# Altium project MiniChessBoard.PrjPcb
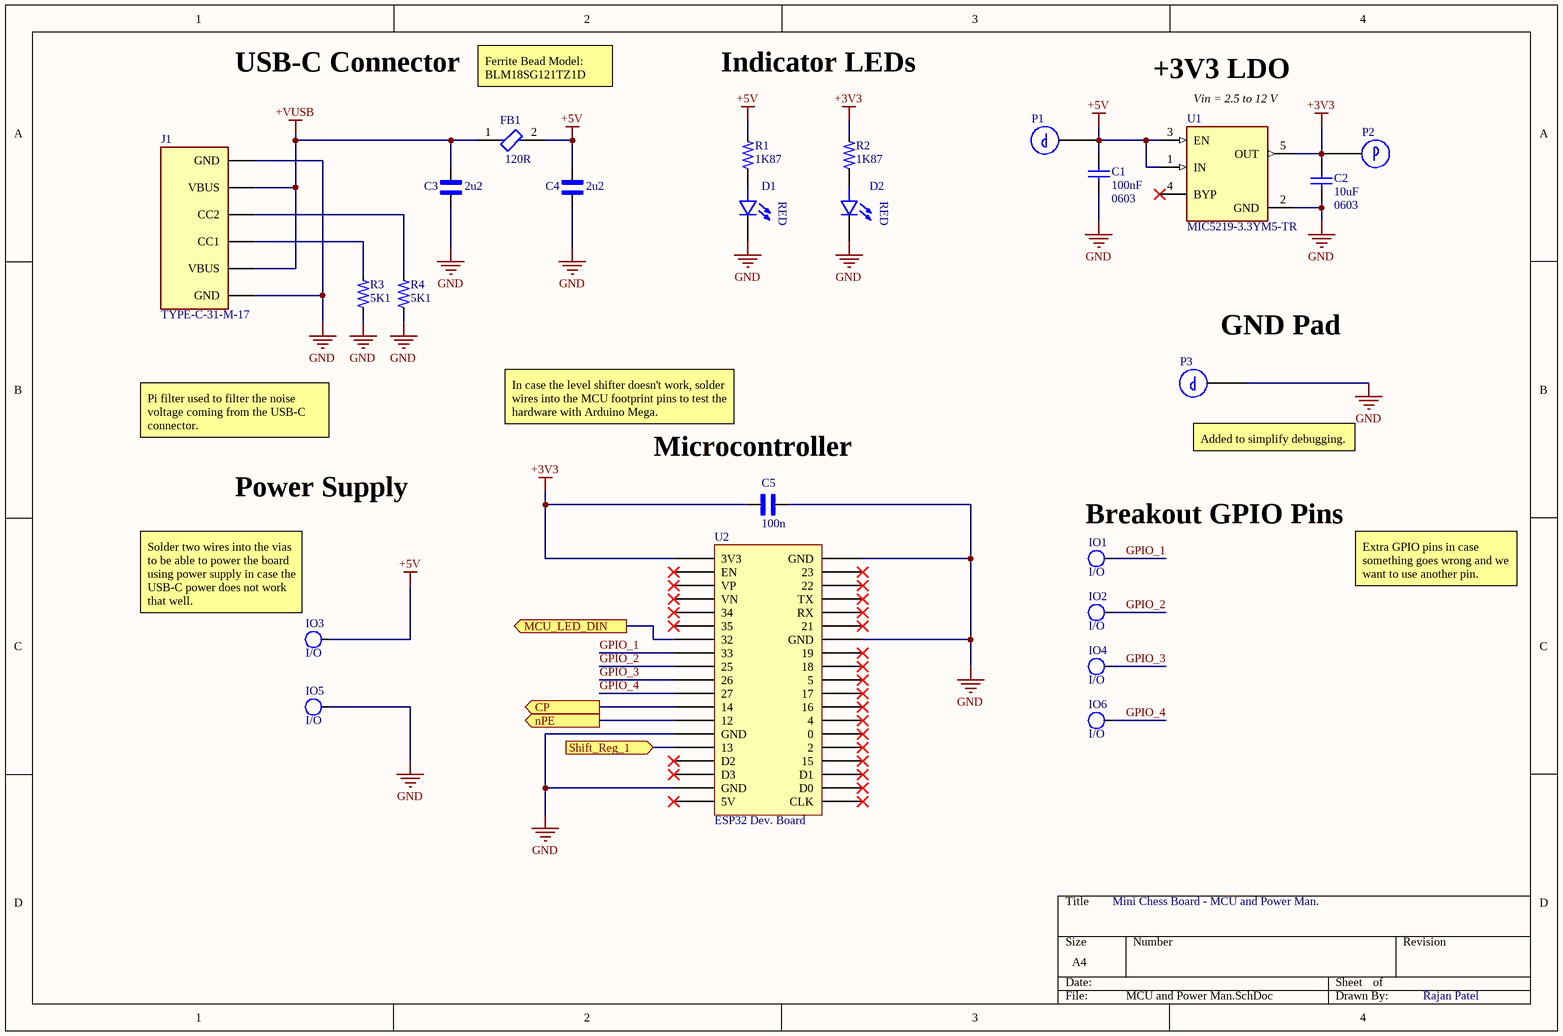
[diagram p0: MCU and Power Man.SchDoc]
4 sheets, 112 parts. Net scope: flat (ports and power ports of the same name join across sheets).
Board file: Mini Chess Board PCB.PcbDoc
Sheets:
  MCU and Power Man.SchDoc
  Reed Switches.SchDoc
  WS2818B.SchDoc
  Shift Registers.SchDoc

## Sheet MCU and Power Man.SchDoc
size A4; SheetNumber: 1; SheetTotal: 4

### Parts
C1  100nF  value 0603  [CAP 0805]
C2  10uF  value 0603  [CAP 0805]
C3  2u2  [CAP 0805]
C4  2u2  [CAP 0805]
C5  100n  [CAP 0805]
D1  LED 0805  [LED_0805]  (value not drawn)
D2  LED 0805  [LED_0805]  (value not drawn)
FB1  120R  [FP-BLM21-0_2-t0_85-e0_5-IPC_A]
IO1  I/O  [I/O]
IO2  I/O  [I/O]
IO3  I/O  [I/O]
IO4  I/O  [I/O]
IO5  I/O  [I/O]
IO6  I/O  [I/O]
J1  TYPE-C-31-M-17  [TYPEC31M17]
P1  Probe_5019  [Testpoint]  (value not drawn)
P2  Probe_5019  [Testpoint]  (value not drawn)
P3  Probe_5019  [Testpoint]  (value not drawn)
R1  1K87  [res 0805]
R2  1K87  [res 0805]
R3  5K1  [res 0805]
R4  5K1  [res 0805]
U1  MIC5219-3.3YM5-TR  [FP-SOT23-5LD-PL-1-IPC_C]
U2  ESP32 Dev. Board  [ESPRESSIF_ESP32-DEVKITC-32UE]

### Ports
CP (out, see Shift Registers[1A]), MCU_LED_DIN (out, see WS2818B[1B]), nPE (out, see Shift Registers[1B]), Shift_Reg_1 (in, see Shift Registers[3B])

### Nets
+3V3: C2.2 C5.2 P2.1 R2.2 U1.5(OUT) U2.1(3V3)
+5V: C1.2 C4.2 FB1.2 IO3.1 P1.1 R1.2 U1.1(IN) U1.3(EN)
+VUSB: C3.2 FB1.1 J1.2(VBUS) J1.5(VBUS)
GND: C1.1 C2.1 C3.1 C4.1 C5.1 D1.1(C) D2.1(C) IO5.1 J1.1(GND) J1.6(GND) P3.1 R3.1 R4.1 U1.2(GND) U2.14(GND) U2.18(GND) U2.32(GND) U2.38(GND)
CP: U2.12(14) ; port CP
GPIO_1: IO1.1 U2.8(33)
GPIO_2: IO2.1 U2.9(25)
GPIO_3: IO4.1 U2.10(26)
GPIO_4: IO6.1 U2.11(27)
nPE: U2.13(12) ; port nPE
NetD1_2: D1.2(A) R1.1
NetD2_2: D2.2(A) R2.1
NetIO8_1: U2.15(13) ; port Shift_Reg_1
NetJ1_3: J1.3(CC1) R3.2
NetJ1_4: J1.4(CC2) R4.2
NetU2_7: U2.7(32) ; port MCU_LED_DIN

Not connected (* = marked no-connect by the designer): U1 4(BYP)*; U2 2(EN)* 3(VP)* 4(VN)* 5(34)* 6(35)* 16(D2)* 17(D3)* 19(5V)* 20(CLK)* 21(D0)* 22(D1)* 23(15)* 24(2)* 25(0)* 26(4)* 27(16)* 28(17)* 29(5)* 30(18)* 31(19)* 33(21)* 34(RX)* 35(TX)* 36(22)* 37(23)*

### Notes on the sheet
- USB-C Connector
- Ferrite Bead Model: BLM18SG121TZ1D
- Indicator LEDs
- +3V3 LDO
- (near U1) Vin = 2.5 to 12 V
- (near P3) GND Pad
- Pi filter used to filter the noise voltage coming from the USB-C connector.
- In case the level shifter doesn't work, solder wires into the MCU footprint pins to test the hardware with Arduino Mega.
- (near P3) Added to simplify debugging.
- Power Supply
- (near C5) Microcontroller
- (near IO1) Breakout GPIO Pins
- Extra GPIO pins in case something goes wrong and we want to use another pin.
- (near IO3) Solder two wires into the vias to be able to power the board using power supply in case the USB-C power does not work that well.
- Mini Chess Board - MCU and Power Man.
- Rajan Patel
- (in symbol LED 0805) RED

### Library data of the parts
C1 C2 = Cap: Capacitor; Published: 8-Jun-2000; LatestRevisionDate: 17-Jul-2002; LatestRevisionNote: Re-released for DXP Platform.; PackageReference: RAD-0.3; Publisher: Altium Limited; PackageDescription: Radial Cap, Thru-Hole; 2 Leads; 0.3 in Pin Spacing
C3-C5 = CAP 0805: SnapEDA_Link: https://www.snapeda.com/parts/C2012X8R1H104K125AA/TDK/view-part/?ref=snap; Check_prices: https://www.snapeda.com/parts/C2012X8R1H104K125AA/TDK/view-part/?ref=eda; Value: *
D1 D2 = LED 0805: Red LED Indication - Discrete 1.7V 0805 (2012 Metric); MP: 7012X1; Package: None; Availability: Unavailable; Value: *; Price: None
FB1 = CMP-0686-00716-3: FERRITE BEAD 120 OHM 0603 1LN; Number of Lines: 1; DC Resistance-Max: 100mR; Material: Steel; Max DC Current: 200mA; Shielding: Unshielded; Test Frequency: 100MHz; Current Rating: 800mA; Max Current Rating: 1A; Resistance: 150mR; Tolerance: 25%; Width: 1.25mm; Number of Circuits: 1; Military Standard: Not; Height: 0.85mm; Series: BLM21A; Min Operating Temperature: -55°C; DC Resistance (DCR): 100mR; Termination: SMD/SMT; Impedance: 120R; Core Material: Ferrite; REACH SVHC: No SVHC; Radiation Hardening: No; Max Operating Temperature: 125°C; Number of Pins: 2; Case/Package: 0805; Case Code (Imperial): 0805; Frequency: 100MHz; Depth: 1.25mm; Length: 2mm; DC Current: 200mA; Lead Free: Lead Free; Case Code (Metric): 2012; Package Quantity: 1; Packaging: Tape and Reel
J1 = TYPE-C-31-M-17: TYPE-C-31-M-17 HROPARTS; MF: HRO Electronics Co., Ltd.; SnapEDA_Link: https://www.snapeda.com/parts/TYPE-C-31-M-17/HRO+Electronics+Co.%252C+Ltd./view-part/?ref=snap; Package: Package; Value: *; MP: TYPE-C-31-M-17; Check_prices: https://www.snapeda.com/parts/TYPE-C-31-M-17/HRO+Electronics+Co.%252C+Ltd./view-part/?ref=eda
P1-P3 = Probe_5019: Phosphor Bronze Contact Miniature Silver Plated Surface Mount Test Points; Manufacturer: Keystone Electronics; Manufacturer Part Number: 5019; Supplier 1: Newark; RoHS: Yes; Category: Connectors; Stock 1: 148000; Pricing 1: 1=0.12300, 1000=0.12300, 2000=0.11700, 4000=0.11300, 6000=0.11000 (USD); Mount: Surface Mount,PCB; Number of Pins: 1; Contact Plating: Silver; Contact Material: Bronze; Material: Bronze; Plating: Silver; Body Material: Bronze; Packaging: Tape and Reel; Package Quantity: 1; Termination: SMD/SMT; Series: 5019; Height: 0.09inch; RoHS Compliant: Yes; Lead Free: Lead Free; Reach SVHC Compliant: Yes; ComponentLink1URL: https://datasheet.ciiva.com/16318/m60-2p61-16318395.pdf?src-supplier=Future+Electronics; ComponentLink1Description: https://datasheet.ciiva.com/16318/m60-2p61-16318395.pdf?src-supplier=Future+Electronics; ComponentLink2URL: https://datasheet.ciiva.com/16885/70182998-16885945.pdf?src-supplier=Allied+Electronics; ComponentLink2Description: https://datasheet.ciiva.com/16885/70182998-16885945.pdf?src-supplier=Allied+Electronics; ComponentLink3URL: https://datasheet.ciiva.com/14848/m60-2p61-14848437.pdf?src-supplier=Digi-Key; ComponentLink3Description: https://datasheet.ciiva.com/14848/m60-2p61-14848437.pdf?src-supplier=Digi-Key; ComponentLink4URL: https://datasheet.ciiva.com/14848/m60-2p61-14848438.pdf?src-supplier=Digi-Key; ComponentLink4Description: https://datasheet.ciiva.com/14848/m60-2p61-14848438.pdf?src-supplier=Digi-Key; ComponentLink5URL: https://datasheet.ciiva.com/14848/m60-2p61-14848439.pdf?src-supplier=Digi-Key; ComponentLink5Description: https://datasheet.ciiva.com/14848/m60-2p61-14848439.pdf?src-supplier=Digi-Key; Supplier Part Number 1: 06W4636
R1-R4 = Resistor 0805: MP: 2-2176053-2; Resistance: .39; Power_Rating: .25 W; MF: TE Connectivity; Tolerance: 1%; Package: 0805; Value: *; SnapEDA_Link: https://www.snapeda.com/parts/2-2176053-2/TE%20Connectivity/view-part/2214511/?ref=snap; Availability: Unavailable; Price: None; EU_RoHS_Compliance: Compliant with Exemptions
U1 = CMP-06324-000027-1: IC REG LINEAR 3.3V 500MA SOT23-5; Dropout Voltage: 350mV; Output Type: Fixed; Number of Regulators: 1; Max Input Voltage: 12V; Min Input Voltage: 2.5V; Min Operating Temperature: -40°C; Nominal Output Voltage: 3.3V; Output Voltage: 3.3V; Packaging: Cut Tape; Mount: Surface Mount; Number of Pins: 5; Case/Package: SOT-23-5; Lead Free: Lead Free; Max Operating Temperature: 125°C; REACH SVHC: No SVHC; Output Current: 500mA
U2 = ESP32 Dev. Board: ESP32-WROOM-32UE Series Evaluation Board 802.11 b/g/n (WiFi, WLAN) Bluetooth Smart Ready 4.x Dual Mode; Manufacturer: Espressif Systems; Manufacturer Part Number: ESP32-DEVKITC-32UE; Supplier: Digikey; Supplier Part Number: 1965-ESP32-DEVKITC-32UE-ND; RoHS: No; Category: RF Semiconductors and Devices; Stock: 498; Pricing: 1=10 (USD); ComponentLink1URL: https://www.espressif.com/sites/default/files/documentation/espressif_products_ordering_information_en.pdf?src-supplier=Digikey; ComponentLink1Description: https://www.espressif.com/sites/default/files/documentation/espressif_products_ordering_information_en.pdf?src-supplier=Digikey; ComponentLink2URL: https://datasheet.octopart.com/ESP32-DEVKITC-32UE-Espressif-Systems-datasheet-165560559.pdf?src-supplier=TME; ComponentLink2Description: https://datasheet.octopart.com/ESP32-DEVKITC-32UE-Espressif-Systems-datasheet-165560559.pdf?src-supplier=TME

## Sheet Reed Switches.SchDoc
size A4; SheetNumber: 2; SheetTotal: 4
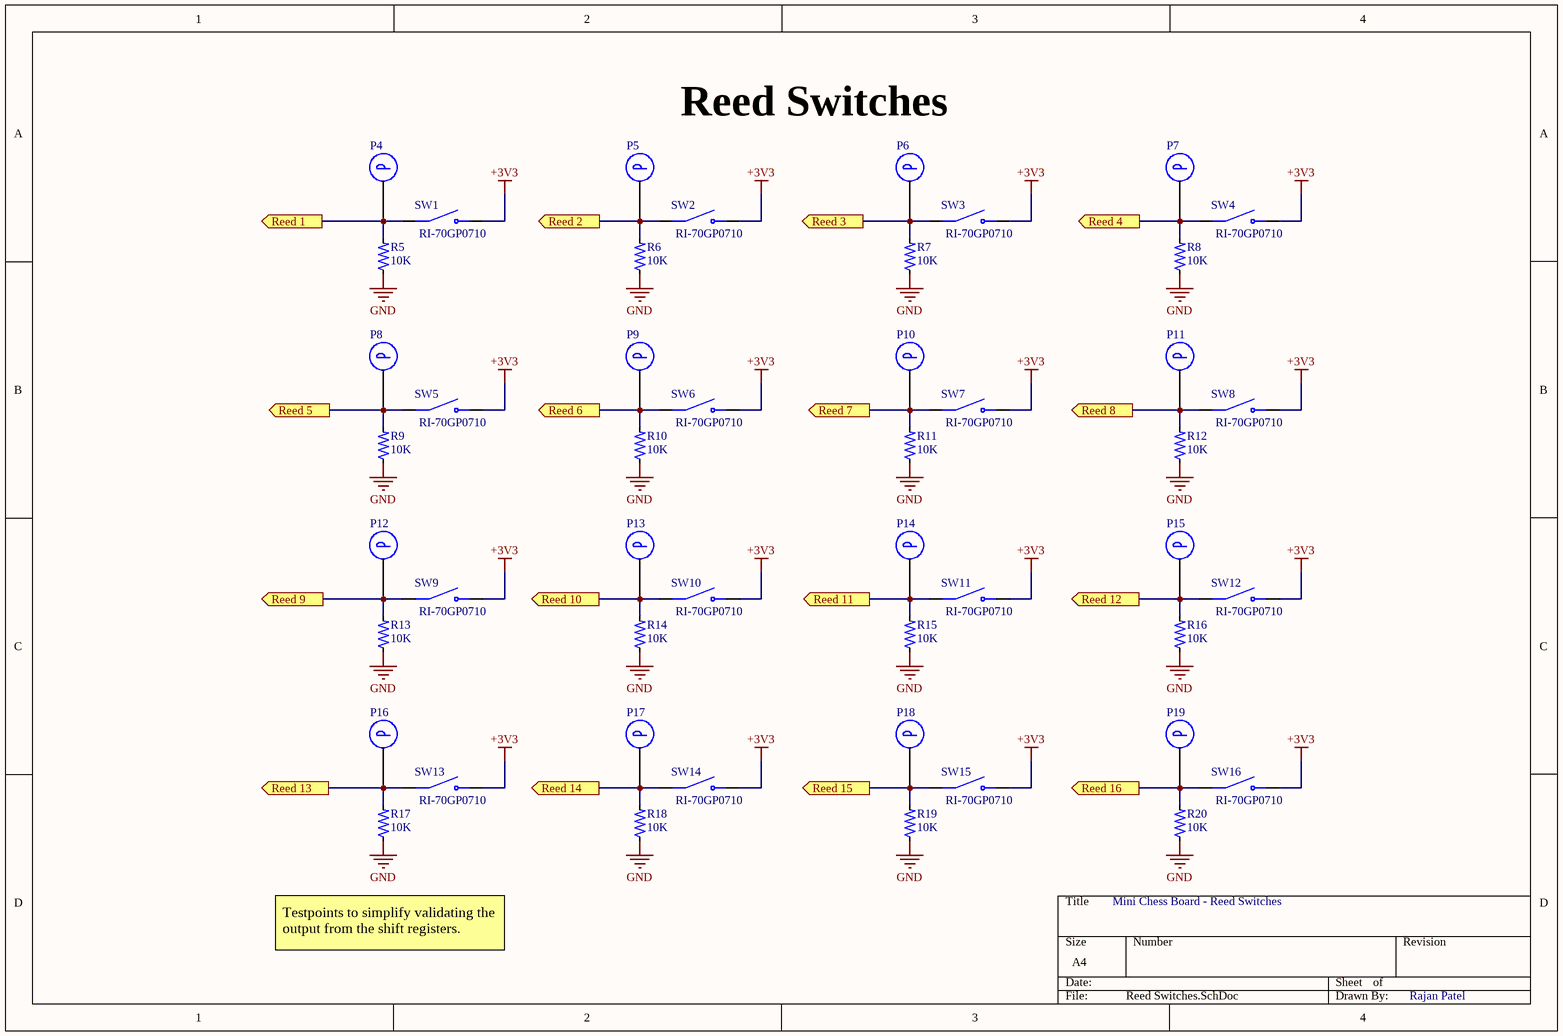
[diagram p1: Reed Switches.SchDoc]

### Parts
P4  Probe_5019  [Testpoint]  (value not drawn)
P5  Probe_5019  [Testpoint]  (value not drawn)
P6  Probe_5019  [Testpoint]  (value not drawn)
P7  Probe_5019  [Testpoint]  (value not drawn)
P8  Probe_5019  [Testpoint]  (value not drawn)
P9  Probe_5019  [Testpoint]  (value not drawn)
P10  Probe_5019  [Testpoint]  (value not drawn)
P11  Probe_5019  [Testpoint]  (value not drawn)
P12  Probe_5019  [Testpoint]  (value not drawn)
P13  Probe_5019  [Testpoint]  (value not drawn)
P14  Probe_5019  [Testpoint]  (value not drawn)
P15  Probe_5019  [Testpoint]  (value not drawn)
P16  Probe_5019  [Testpoint]  (value not drawn)
P17  Probe_5019  [Testpoint]  (value not drawn)
P18  Probe_5019  [Testpoint]  (value not drawn)
P19  Probe_5019  [Testpoint]  (value not drawn)
R5  10K  [res 0805]
R6  10K  [res 0805]
R7  10K  [res 0805]
R8  10K  [res 0805]
R9  10K  [res 0805]
R10  10K  [res 0805]
R11  10K  [res 0805]
R12  10K  [res 0805]
R13  10K  [res 0805]
R14  10K  [res 0805]
R15  10K  [res 0805]
R16  10K  [res 0805]
R17  10K  [res 0805]
R18  10K  [res 0805]
R19  10K  [res 0805]
R20  10K  [res 0805]
SW1  RI-70GP0710  [RI-70GP0710]
SW2  RI-70GP0710  [RI-70GP0710]
SW3  RI-70GP0710  [RI-70GP0710]
SW4  RI-70GP0710  [RI-70GP0710]
SW5  RI-70GP0710  [RI-70GP0710]
SW6  RI-70GP0710  [RI-70GP0710]
SW7  RI-70GP0710  [RI-70GP0710]
SW8  RI-70GP0710  [RI-70GP0710]
SW9  RI-70GP0710  [RI-70GP0710]
SW10  RI-70GP0710  [RI-70GP0710]
SW11  RI-70GP0710  [RI-70GP0710]
SW12  RI-70GP0710  [RI-70GP0710]
SW13  RI-70GP0710  [RI-70GP0710]
SW14  RI-70GP0710  [RI-70GP0710]
SW15  RI-70GP0710  [RI-70GP0710]
SW16  RI-70GP0710  [RI-70GP0710]

### Ports
Reed 1 (out, see Shift Registers[3C]), Reed 2 (out, see Shift Registers[3C]), Reed 3 (out, see Shift Registers[3C]), Reed 4 (out, see Shift Registers[3C]), Reed 5 (out, see Shift Registers[3B]), Reed 6 (out, see Shift Registers[3B]), Reed 7 (out, see Shift Registers[3B]), Reed 8 (out, see Shift Registers[3C]), Reed 9 (out, see Shift Registers[1C]), Reed 10 (out, see Shift Registers[1C]), Reed 11 (out, see Shift Registers[1C]), Reed 12 (out, see Shift Registers[1C]), Reed 13 (out, see Shift Registers[1B]), Reed 14 (out, see Shift Registers[1B]), Reed 15 (out, see Shift Registers[1B]), Reed 16 (out, see Shift Registers[1C])

### Nets
+3V3: SW1.2(NO) SW2.2(NO) SW3.2(NO) SW4.2(NO) SW5.2(NO) SW6.2(NO) SW7.2(NO) SW8.2(NO) SW9.2(NO) SW10.2(NO) SW11.2(NO) SW12.2(NO) SW13.2(NO) SW14.2(NO) SW15.2(NO) SW16.2(NO)
GND: R5.1 R6.1 R7.1 R8.1 R9.1 R10.1 R11.1 R12.1 R13.1 R14.1 R15.1 R16.1 R17.1 R18.1 R19.1 R20.1
R1: P4.1 R5.2 SW1.1(COM) ; port Reed 1
R2: P5.1 R6.2 SW2.1(COM) ; port Reed 2
R3: P6.1 R7.2 SW3.1(COM) ; port Reed 3
R4: P7.1 R8.2 SW4.1(COM) ; port Reed 4
R5: P8.1 R9.2 SW5.1(COM) ; port Reed 5
R6: P9.1 R10.2 SW6.1(COM) ; port Reed 6
R7: P10.1 R11.2 SW7.1(COM) ; port Reed 7
R8: P11.1 R12.2 SW8.1(COM) ; port Reed 8
R9: P12.1 R13.2 SW9.1(COM) ; port Reed 9
R10: P13.1 R14.2 SW10.1(COM) ; port Reed 10
R11: P14.1 R15.2 SW11.1(COM) ; port Reed 11
R12: P15.1 R16.2 SW12.1(COM) ; port Reed 12
R13: P16.1 R17.2 SW13.1(COM) ; port Reed 13
R14: P17.1 R18.2 SW14.1(COM) ; port Reed 14
R15: P18.1 R19.2 SW15.1(COM) ; port Reed 15
R16: P19.1 R20.2 SW16.1(COM) ; port Reed 16

### Notes on the sheet
- Reed Switches
- Mini Chess Board - Reed Switches
- Testpoints to simplify validating the output from the shift registers.
- Rajan Patel

### Library data of the parts
P4-P19 = Probe_5019: as P1 on sheet MCU and Power Man; Supplier 1: Newark; RoHS: Yes; Category: Connectors; Stock 1: 148000; Pricing 1: 1=0.12300, 1000=0.12300, 2000=0.11700, 4000=0.11300, 6000=0.11000 (USD); Mount: Surface Mount,PCB; Number of Pins: 1; Contact Plating: Silver; Contact Material: Bronze; Material: Bronze; Plating: Silver; Body Material: Bronze; Packaging: Tape and Reel; Package Quantity: 1; Termination: SMD/SMT; Series: 5019; Height: 0.09inch; RoHS Compliant: Yes; Lead Free: Lead Free; Reach SVHC Compliant: Yes; ComponentLink1URL: https://datasheet.ciiva.com/16318/m60-2p61-16318395.pdf?src-supplier=Future+Electronics; ComponentLink1Description: https://datasheet.ciiva.com/16318/m60-2p61-16318395.pdf?src-supplier=Future+Electronics; ComponentLink2URL: https://datasheet.ciiva.com/16885/70182998-16885945.pdf?src-supplier=Allied+Electronics; ComponentLink2Description: https://datasheet.ciiva.com/16885/70182998-16885945.pdf?src-supplier=Allied+Electronics; ComponentLink3URL: https://datasheet.ciiva.com/14848/m60-2p61-14848437.pdf?src-supplier=Digi-Key; ComponentLink3Description: https://datasheet.ciiva.com/14848/m60-2p61-14848437.pdf?src-supplier=Digi-Key; ComponentLink4URL: https://datasheet.ciiva.com/14848/m60-2p61-14848438.pdf?src-supplier=Digi-Key; ComponentLink4Description: https://datasheet.ciiva.com/14848/m60-2p61-14848438.pdf?src-supplier=Digi-Key; ComponentLink5URL: https://datasheet.ciiva.com/14848/m60-2p61-14848439.pdf?src-supplier=Digi-Key; ComponentLink5Description: https://datasheet.ciiva.com/14848/m60-2p61-14848439.pdf?src-supplier=Digi-Key; Supplier Part Number 1: 06W4636
R5-R20 = Resistor 0805: as R1 on sheet MCU and Power Man; Package: 0805; Value: *; SnapEDA_Link: https://www.snapeda.com/parts/2-2176053-2/TE%20Connectivity/view-part/2214511/?ref=snap; Availability: Unavailable; Price: None; EU_RoHS_Compliance: Compliant with Exemptions
SW1-SW16 = RI-70GP0710: Switch Reed Spst-no 500MA 120V; Manufacturer: Comus; Supplier: Digikey; Supplier Part Number: 1835-1025-ND; Manufacturer Part Number: RI-70GP0710; RoHS: No; Stock: 52347; Pricing: 1=1.05, 10=1.01, 25=0.9496, 100=0.8201, 250=0.7474, 500=0.69488, 2000=0.6464, 4000=0.5858, 6000=0.5454 (USD); ComponentLink1URL: https://www.comus-intl.com/wp-content/uploads/2018/10/RI-70GP.pdf?src-supplier=Digikey; ComponentLink1Description: https://www.comus-intl.com/wp-content/uploads/2018/10/RI-70GP.pdf?src-supplier=Digikey

## Sheet WS2818B.SchDoc
size A4; SheetNumber: 3; SheetTotal: 4
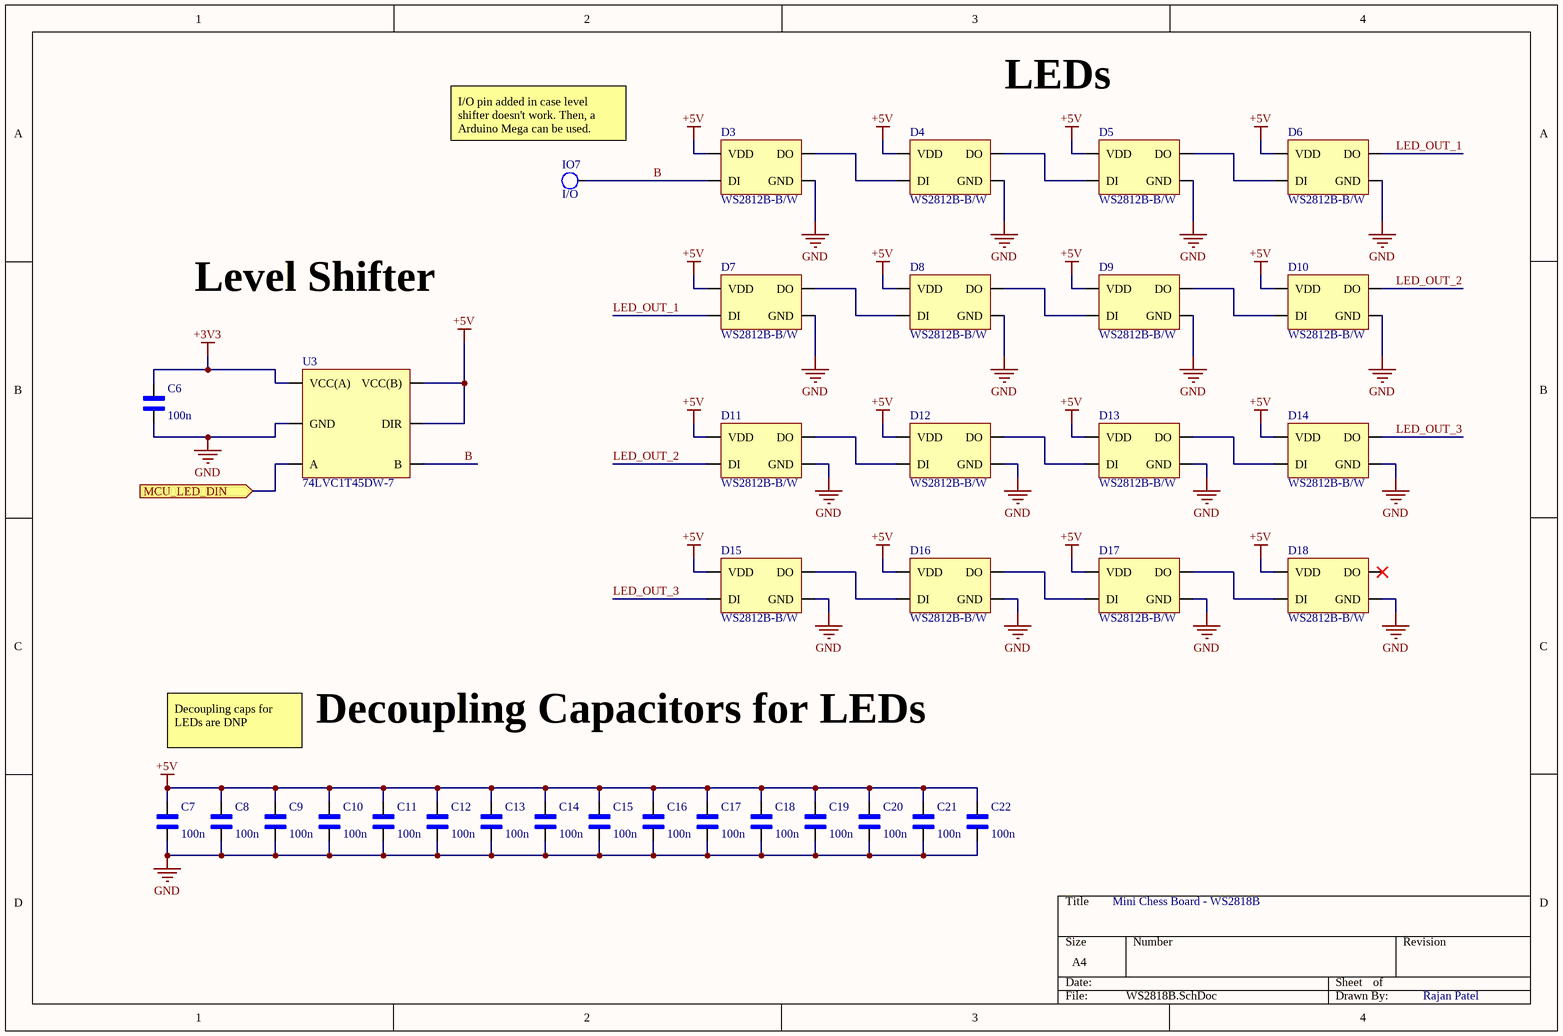
[diagram p2: WS2818B.SchDoc]

### Parts
C6  100n  [CAP 0805]
C7  100n  [CAP 0805]
C8  100n  [CAP 0805]
C9  100n  [CAP 0805]
C10  100n  [CAP 0805]
C11  100n  [CAP 0805]
C12  100n  [CAP 0805]
C13  100n  [CAP 0805]
C14  100n  [CAP 0805]
C15  100n  [CAP 0805]
C16  100n  [CAP 0805]
C17  100n  [CAP 0805]
C18  100n  [CAP 0805]
C19  100n  [CAP 0805]
C20  100n  [CAP 0805]
C21  100n  [CAP 0805]
C22  100n  [CAP 0805]
D3  WS2812B-B/W  [WS2812B-B/W]
D4  WS2812B-B/W  [WS2812B-B/W]
D5  WS2812B-B/W  [WS2812B-B/W]
D6  WS2812B-B/W  [WS2812B-B/W]
D7  WS2812B-B/W  [WS2812B-B/W]
D8  WS2812B-B/W  [WS2812B-B/W]
D9  WS2812B-B/W  [WS2812B-B/W]
D10  WS2812B-B/W  [WS2812B-B/W]
D11  WS2812B-B/W  [WS2812B-B/W]
D12  WS2812B-B/W  [WS2812B-B/W]
D13  WS2812B-B/W  [WS2812B-B/W]
D14  WS2812B-B/W  [WS2812B-B/W]
D15  WS2812B-B/W  [WS2812B-B/W]
D16  WS2812B-B/W  [WS2812B-B/W]
D17  WS2812B-B/W  [WS2812B-B/W]
D18  WS2812B-B/W  [WS2812B-B/W]
IO7  I/O  [I/O]
U3  74LVC1T45DW-7  [74LVC1T45DW-7]

### Ports
MCU_LED_DIN (in, see MCU and Power Man[2C])

### Nets
+3V3: C6.2 U3.1(VCC(A))
+5V: C7.2 C8.2 C9.2 C10.2 C11.2 C12.2 C13.2 C14.2 C15.2 C16.2 C17.2 C18.2 C19.2 C20.2 C21.2 C22.2 D3.1(VDD) D4.1(VDD) D5.1(VDD) D6.1(VDD) D7.1(VDD) D8.1(VDD) D9.1(VDD) D10.1(VDD) D11.1(VDD) D12.1(VDD) D13.1(VDD) D14.1(VDD) D15.1(VDD) D16.1(VDD) D17.1(VDD) D18.1(VDD) U3.5(DIR) U3.6(VCC(B))
GND: C6.1 C7.1 C8.1 C9.1 C10.1 C11.1 C12.1 C13.1 C14.1 C15.1 C16.1 C17.1 C18.1 C19.1 C20.1 C21.1 C22.1 D3.4(GND) D4.4(GND) D5.4(GND) D6.4(GND) D7.4(GND) D8.4(GND) D9.4(GND) D10.4(GND) D11.4(GND) D12.4(GND) D13.4(GND) D14.4(GND) D15.4(GND) D16.4(GND) D17.4(GND) D18.4(GND) U3.2(GND)
B: D3.2(DI) IO7.1 U3.4(B)
LED_OUT_1: D6.3(DO) D7.2(DI)
LED_OUT_2: D10.3(DO) D11.2(DI)
LED_OUT_3: D14.3(DO) D15.2(DI)
NetD3_3: D3.3(DO) D4.2(DI)
NetD4_3: D4.3(DO) D5.2(DI)
NetD5_3: D5.3(DO) D6.2(DI)
NetD7_3: D7.3(DO) D8.2(DI)
NetD8_3: D8.3(DO) D9.2(DI)
NetD9_3: D9.3(DO) D10.2(DI)
NetD11_3: D11.3(DO) D12.2(DI)
NetD12_3: D12.3(DO) D13.2(DI)
NetD13_3: D13.3(DO) D14.2(DI)
NetD15_3: D15.3(DO) D16.2(DI)
NetD16_3: D16.3(DO) D17.2(DI)
NetD17_3: D17.3(DO) D18.2(DI)
NetU2_7: U3.3(A) ; port MCU_LED_DIN

Not connected (* = marked no-connect by the designer): D18 3(DO)*

### Notes on the sheet
- LEDs
- (near IO7) I/O pin added in case level shifter doesn't work. Then, a Arduino Mega can be used.
- Level Shifter
- Decoupling caps for LEDs are DNP
- Decoupling Capacitors for LEDs
- Mini Chess Board - WS2818B
- Rajan Patel

### Library data of the parts
C6-C22 = CAP 0805: SnapEDA_Link: https://www.snapeda.com/parts/C2012X8R1H104K125AA/TDK/view-part/?ref=snap; Check_prices: https://www.snapeda.com/parts/C2012X8R1H104K125AA/TDK/view-part/?ref=eda; Value: *
D3-D18 = WS2812B-B/W: SMD5050 RGB LEDs(Built-in IC) ROHS; Manufacturer: Worldsemi; Supplier: LCSC; Supplier Part Number: C114586; Manufacturer Part Number: WS2812B-B/W
U3 = 74LVC1T45DW-7: Bus Transceiver, LVC/LCX/Z Series, 1-Func, 1-Bit, True Output, CMOS, PDSO6; Manufacturer: Diodes; Package Body Material: Plastic; Control Type: COMMON CONTROL; Count Direction: Bidirectional; Load/Preset Input: Yes; Max I(ol): 24mA; Number of Bits: 1; Number of Ports: 2; Output Characteristics: 3-STATE; Package Equivalence Code: TSSOP6,.08; Power Supplies: 3.3V; Max Supply Voltage: 5.5V; Min Supply Voltage: 1.65V; Qualification Status: Not Qualified; Supplier: Future Electronics; Supplier Part Number: 3070442; Manufacturer Part Number: 74LVC1T45DW-7; RoHS: Yes; Stock: 42000; Pricing: 3000=0.0512, 9000=0.0494, 15000=0.0485, 60000=0.0463, 90000=0.0449 (USD); Case/Package: TSSOP; Pins: 6; Package Shape: Rectangular; Terminal Finish: Tin; Min Operating Temperature: -40°C; Max Operating Temperature: 125°C; JESD-609 Code: e3; Output Polarity: True; JESD-30 Code: R-PDSO-G6; Logic Type: BUS TRANSCEIVER; Moisture Sensitivity Level: 1; Channels: 1; Package Style: SMALL OUTLINE, THIN PROFILE, SHRINK PITCHMeter; Packaging: Tape and Reel; Nominal Supply Voltage: 3.3V; Surface Mount: Yes; Technology: CMOS; Terminal Form: Gull Wing; Terminal Position: DUAL; Length: 2mm; Width: 1.25mm; Height - Seated (Max): 1.1mm; Terminal Pitch: 0.65mm; Temperature Grade: AUTOMOTIVE; Reach SVHC Compliant: Yes; RoHS Compliant: Yes; ComponentLink1URL: https://datasheet.ciiva.com:443/pdfs/VipMasterIC/IC/DIOD/DIOD-S-A0006644025/DIOD-S-A0006644025-1.pdf?src-supplier=IHS+Markit; ComponentLink1Description: https://datasheet.ciiva.com:443/pdfs/VipMasterIC/IC/DIOD/DIOD-S-A0006644025/DIOD-S-A0006644025-1.pdf?src-supplier=IHS+Markit; ComponentLink2URL: http://www.mouser.com/ds/2/115/74LVC1T45-318124.pdf?src-supplier=Mouser; ComponentLink2Description: http://www.mouser.com/ds/2/115/74LVC1T45-318124.pdf?src-supplier=Mouser; ComponentLink3URL: https://www.diodes.com/assets/Datasheets/74LVC1T45.pdf?src-supplier=Digikey; ComponentLink3Description: https://www.diodes.com/assets/Datasheets/74LVC1T45.pdf?src-supplier=Digikey; ComponentLink4URL: https://datasheet.octopart.com/74LVC1T45DW-7-Diodes-Inc.-datasheet-160640065.pdf?src-supplier=Newark; ComponentLink4Description: https://datasheet.octopart.com/74LVC1T45DW-7-Diodes-Inc.-datasheet-160640065.pdf?src-supplier=Newark; ComponentLink5URL: http://www.diodes.com/datasheets/74LVC1T45.pdf?src-supplier=Avnet; ComponentLink5Description: http://www.diodes.com/datasheets/74LVC1T45.pdf?src-supplier=Avnet

## Sheet Shift Registers.SchDoc
size A4; SheetNumber: 4; SheetTotal: 4
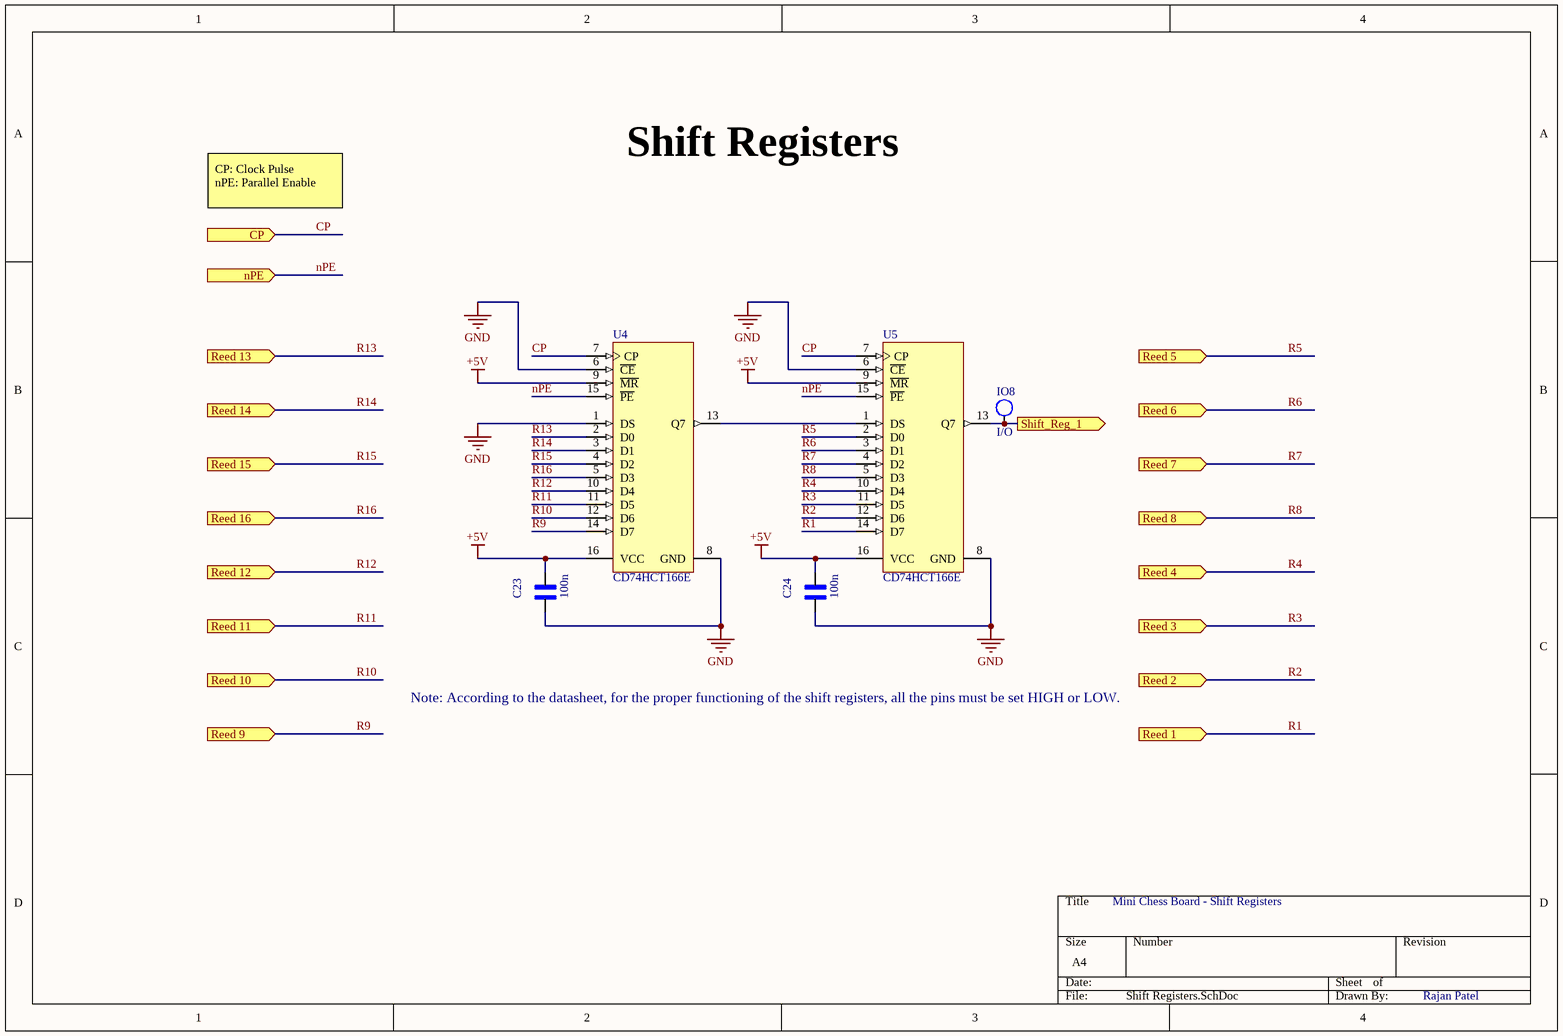
[diagram p3: Shift Registers.SchDoc]

### Parts
C23  100n  [CAP 0805]
C24  100n  [CAP 0805]
IO8  I/O  [I/O]
U4  CD74HCT166E  [N0016A]
U5  CD74HCT166E  [N0016A]

### Ports
CP (in, see MCU and Power Man[2C]), nPE (in, see MCU and Power Man[2C]), Reed 1 (in, see Reed Switches[1A]), Reed 2 (in, see Reed Switches[2A]), Reed 3 (in, see Reed Switches[3A]), Reed 4 (in, see Reed Switches[3A]), Reed 5 (in, see Reed Switches[1B]), Reed 6 (in, see Reed Switches[2B]), Reed 7 (in, see Reed Switches[3B]), Reed 8 (in, see Reed Switches[3B]), Reed 9 (in, see Reed Switches[1C]), Reed 10 (in, see Reed Switches[2C]), Reed 11 (in, see Reed Switches[3C]), Reed 12 (in, see Reed Switches[3C]), Reed 13 (in, see Reed Switches[1D]), Reed 14 (in, see Reed Switches[2D]), Reed 15 (in, see Reed Switches[3D]), Reed 16 (in, see Reed Switches[3D]), Shift_Reg_1 (out, see MCU and Power Man[2C])

### Nets
+5V: C23.2 C24.2 U4.9(~{MR}) U4.16(VCC) U5.9(~{MR}) U5.16(VCC)
GND: C23.1 C24.1 U4.1(DS) U4.6(~{CE}) U4.8(GND) U5.6(~{CE}) U5.8(GND)
CP: U4.7(CP) U5.7(CP) ; port CP
nPE: U4.15(~{PE}) U5.15(~{PE}) ; port nPE
R1: U5.14(D7) ; port Reed 1
R2: U5.12(D6) ; port Reed 2
R3: U5.11(D5) ; port Reed 3
R4: U5.10(D4) ; port Reed 4
R5: U5.2(D0) ; port Reed 5
R6: U5.3(D1) ; port Reed 6
R7: U5.4(D2) ; port Reed 7
R8: U5.5(D3) ; port Reed 8
R9: U4.14(D7) ; port Reed 9
R10: U4.12(D6) ; port Reed 10
R11: U4.11(D5) ; port Reed 11
R12: U4.10(D4) ; port Reed 12
R13: U4.2(D0) ; port Reed 13
R14: U4.3(D1) ; port Reed 14
R15: U4.4(D2) ; port Reed 15
R16: U4.5(D3) ; port Reed 16
NetIO8_1: IO8.1 U5.13(Q7) ; port Shift_Reg_1
NetU4_13: U4.13(Q7) U5.1(DS)

### Notes on the sheet
- Shift Registers
- CP: Clock Pulse
  nPE: Parallel Enable
- Note: According to the datasheet, for the proper functioning of the shift registers, all the pins must be set HIGH or LOW.
- Mini Chess Board - Shift Registers
- Rajan Patel

### Library data of the parts
C23 C24 = CAP 0805: SnapEDA_Link: https://www.snapeda.com/parts/C2012X8R1H104K125AA/TDK/view-part/?ref=snap; Check_prices: https://www.snapeda.com/parts/C2012X8R1H104K125AA/TDK/view-part/?ref=eda; Value: *
U4 U5 = CMP-0807-00166-3: High Speed CMOS Logic 8-Bit Parallel-In/Serial-Out Shift Register, N0016A, TUBE; Manufacturer: Texas Instruments; Voltage(Nom)(V): 5; Bits: 8; Output Drive (IOL/IOH)(Max)(mA): 4/-4; F @ Nom Voltage(Max)(Mhz): 25; VCC(Max)(V): 5.5; 3-State Output: No; VCC(Min)(V): 4.5; tpd @ Nom Voltage(Max)(ns): 50; Technology Family: HCT; Input Type: TTL; ICC @ Nom Voltage(Max)(mA): 0.08; Rating: Catalog; Operating Temperature Range(C): -55 to 125; PackageVersion: http://www.ti.com/lit/ml/mpdi002c/mpdi002c.pdf; DatasheetVersion: SCHS157C; Generic Part Number: CD74HCT166; PackageReference: N0016A; Code_JEDEC: MS-001; Output Type: CMOS

## Nets that join several sheets
+3V3: MCU and Power Man (6 pins), Reed Switches (16 pins), WS2818B (C6.2 U3.1)
+5V: MCU and Power Man (8 pins), WS2818B (34 pins), Shift Registers (6 pins)
GND: MCU and Power Man (18 pins), Reed Switches (16 pins), WS2818B (34 pins), Shift Registers (7 pins)
CP: MCU and Power Man (U2.12), Shift Registers (U4.7 U5.7)
NetIO8_1: MCU and Power Man (U2.15), Shift Registers (IO8.1 U5.13)
NetU2_7: MCU and Power Man (U2.7), WS2818B (U3.3)
nPE: MCU and Power Man (U2.13), Shift Registers (U4.15 U5.15)
R1: Reed Switches (P4.1 R5.2 SW1.1), Shift Registers (U5.14)
R2: Reed Switches (P5.1 R6.2 SW2.1), Shift Registers (U5.12)
R3: Reed Switches (P6.1 R7.2 SW3.1), Shift Registers (U5.11)
R4: Reed Switches (P7.1 R8.2 SW4.1), Shift Registers (U5.10)
R5: Reed Switches (P8.1 R9.2 SW5.1), Shift Registers (U5.2)
R6: Reed Switches (P9.1 R10.2 SW6.1), Shift Registers (U5.3)
R7: Reed Switches (P10.1 R11.2 SW7.1), Shift Registers (U5.4)
R8: Reed Switches (P11.1 R12.2 SW8.1), Shift Registers (U5.5)
R9: Reed Switches (P12.1 R13.2 SW9.1), Shift Registers (U4.14)
R10: Reed Switches (P13.1 R14.2 SW10.1), Shift Registers (U4.12)
R11: Reed Switches (P14.1 R15.2 SW11.1), Shift Registers (U4.11)
R12: Reed Switches (P15.1 R16.2 SW12.1), Shift Registers (U4.10)
R13: Reed Switches (P16.1 R17.2 SW13.1), Shift Registers (U4.2)
R14: Reed Switches (P17.1 R18.2 SW14.1), Shift Registers (U4.3)
R15: Reed Switches (P18.1 R19.2 SW15.1), Shift Registers (U4.4)
R16: Reed Switches (P19.1 R20.2 SW16.1), Shift Registers (U4.5)